# EAGLE schematic uSBasp (EAGLE 6.4)
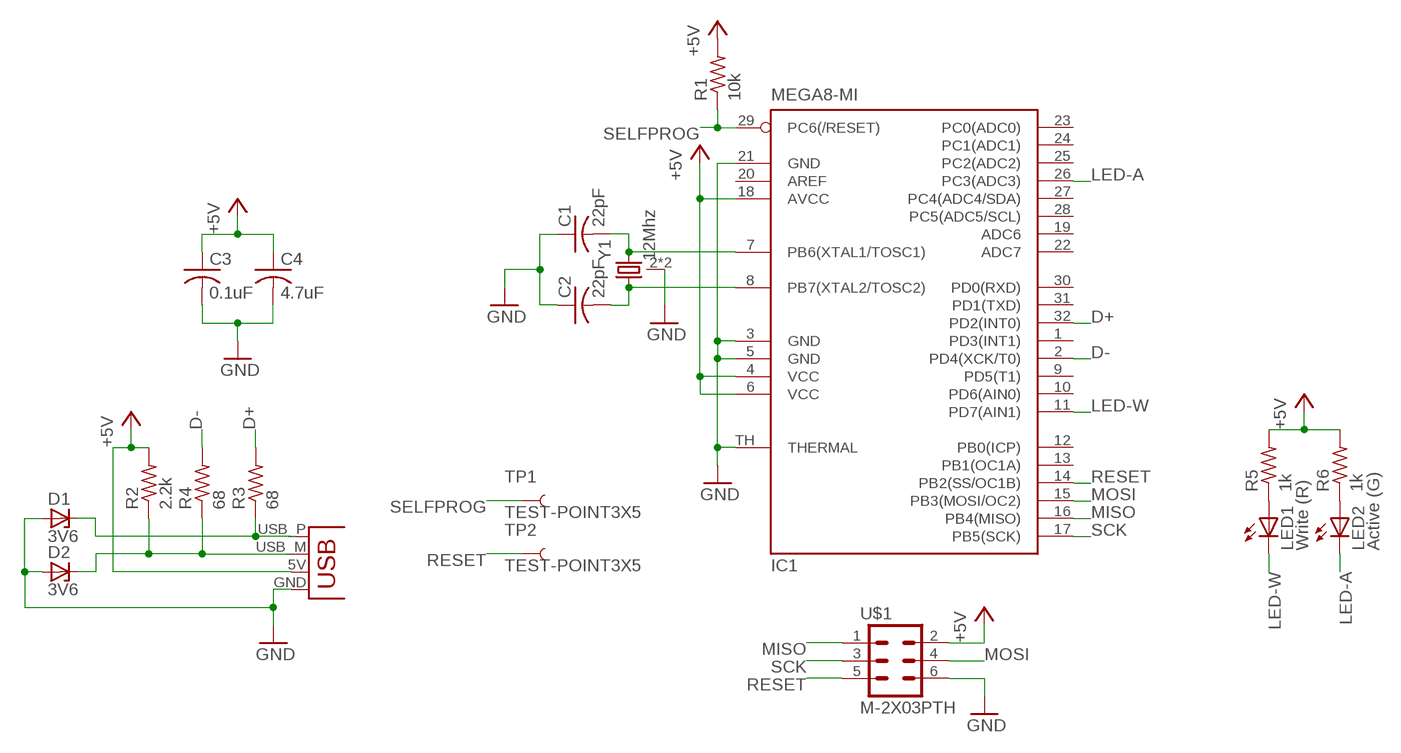
[diagram p0: schematic, sheet 1]

## Parts
C1  22pF  C-USC0402  [C0402]
C2  22pF  C-USC0402  [C0402]
C3  0.1uF  C-USC0402  [C0402]
C4  4.7uF  C-USC0402  [C0402]
D1  3V6  ZENER-DIODESOT23  [SOT23]
D2  3V6  ZENER-DIODESOT23  [SOT23]
IC1  MEGA8-MI  [MLF32-TH]
LED1  Write (R)  LEDSML0603  [SML0603]
LED2  Active (G)  LEDSML0603  [SML0603]
R1  10k  R-US_R0402  [R0402]
R2  2.2k  R-US_R0402  [R0402]
R3  68  R-US_R0402  [R0402]
R4  68  R-US_R0402  [R0402]
R5  1k  R-US_R0402  [R0402]
R6  1k  R-US_R0402  [R0402]
TP1  TEST-POINT3X5  [PAD.03X.05]
TP2  TEST-POINT3X5  [PAD.03X.05]
U$1  M-2X03PTH  [M-2X03-0.1-PTH-EDGE]
X1  USBPCB  [USB-A-PCB]
Y1  12Mhz  CRYSTAL  [CRYSTAL-SMD-3.2X2.5]

## Nets
+5V: C3.1 C4.1 IC1.4(VCC) IC1.6(VCC) IC1.18(AVCC) R1.2 R2.2 R5.2 R6.2 U$1.2 X1.5V(VBUS)
D+: IC1.32(PD2(INT0)) R3.2
D-: IC1.2(PD4(XCK/T0)) R4.2
GND: C1.1 C2.1 C3.2 C4.2 D1.1(A) D2.1(A) IC1.3(GND) IC1.5(GND) IC1.21(GND) IC1.TH(THERMAL) U$1.6 X1.GND Y1.2(GND) Y1.4(GND)
LED-A: IC1.26(PC3(ADC3)) LED2.C
LED-W: IC1.11(PD7(AIN1)) LED1.C
MISO: IC1.16(PB4(MISO)) U$1.1
MOSI: IC1.15(PB3(MOSI/OC2)) U$1.4
N$1: LED1.A R5.1
N$2: LED2.A R6.1
N$3: D1.3(C) R3.1 X1.USB_P(D+)
N$4: D2.3(C) R2.1 R4.1 X1.USB_M(D-)
N$6: C1.2 IC1.7(PB6(XTAL1/TOSC1)) Y1.3
N$7: C2.2 IC1.8(PB7(XTAL2/TOSC2)) Y1.1
RESET: IC1.14(PB2(SS/OC1B)) TP2.P$1 U$1.5
SCK: IC1.17(PB5(SCK)) U$1.3
SELFPROG: IC1.29(PC6(/RESET)) R1.1 TP1.P$1
Unconnected: IC1.1(PD3(INT1)) IC1.9(PD5(T1)) IC1.10(PD6(AIN0)) IC1.12(PB0(ICP)) IC1.13(PB1(OC1A)) IC1.19(ADC6) IC1.20(AREF) IC1.22(ADC7) IC1.23(PC0(ADC0)) IC1.24(PC1(ADC1)) IC1.25(PC2(ADC2)) IC1.27(PC4(ADC4/SDA)) IC1.28(PC5(ADC5/SCL)) IC1.30(PD0(RXD)) IC1.31(PD1(TXD))

## Library data of the parts
C1-C4 = rcl:C-US: CAPACITOR, American symbol
D1 D2 = diode:ZENER-DIODE: Z-Diode
IC1 = atmel:MEGA8-MI: MICROCONTROLLER 8 Kbytes FLASH, 1 kbytes SRAM, 512 bytes EEPROM, USART, 6-channel 10 bit ADC, 2-channel 8 bit ADC Pin compatible with Atmega48, ATMega88, ATMega168 Source: avr.lbr; MPN: ATMEGA88PA-MU; OC_FARNELL: 1715491; OC_NEWARK: 15R0272
LED1 LED2 = led:LED: LED OSRAM: - CHIPLED LG R971, LG N971, LY N971, LG Q971, LY Q971, LO R971, LY R971 LH N974, LH R974 LS Q976, LO Q976, LY Q976 LO Q996 - Hyper CHIPLED LW Q18S LB Q993, LB Q99A, LB R99A - SideLED LS A670, LO A670, LY A670, LG A670, LP A670 LB A673, LV A673, LT A673, LW A673 LH A674 LY A675 LS A676, LA A676, LO A676, LY A676, LW A676 LS A679, LY A679, LG A679 - Hyper Micro SIDELED® LS Y876, LA Y876, LO Y876, LY Y876 LT Y87S - SmartLED LW L88C, LW L88S LB L89C, LB L89S, LG L890 LS L89K, LO L89K, LY L89K LS L896, LA L896, LO L896, LY L896 - TOPLED LS T670, LO T670, LY T670, LG T670, LP T670 LSG T670, LSP T670, LSY T670, LOP T670, LYG T670 LG T671, LOG T671, LSG T671 LB T673, LV T673, LT T673, LW T673 LH T674 LS T676, LA T676, LO T676, LY T676, LB T676, LH T676, LSB T676, LW T676 LB T67C, LV T67C, LT T67C, LS T67K, LO T67K, LY T67K, LW E67C LS E67B, LA E67B, LO E67B, LY E67B, LB E67C, LV E67C, LT E67C LW T67C LS T679, LY T679, LG T679 LS T770, LO T770, LY T770, LG T770, LP T770 LB T773, LV T773, LT T773, LW T773 LH T774 LS E675, LA E675, LY E675, LS T675 LS T776, LA T776, LO T776, LY T776, LB T776 LHGB T686 LT T68C, LB T68C - Hyper Mini TOPLED® LB M676 - Mini TOPLED Santana® LG M470 LS M47K, LO M47K, LY M47K Source: http://www.osram.convergy.de LUXEON: - LUMILED® LXK2-PW12-R00, LXK2-PW12-S00, LXK2-PW14-U00, LXK2-PW14-V00 LXK2-PM12-R00, LXK2-PM12-S00, LXK2-PM14-U00 LXK2-PE12-Q00, LXK2-PE12-R00, LXK2-PE12-S00, LXK2-PE14-T00, LXK2-PE14-U00 LXK2-PB12-K00, LXK2-PB12-L00, LXK2-PB12-M00, LXK2-PB14-N00, LXK2-PB14-P00, LXK2-PB14-Q00 LXK2-PR12-L00, LXK2-PR12-M00, LXK2-PR14-Q00, LXK2-PR14-R00 LXK2-PD12-Q00, LXK2-PD12-R00, LXK2-PD12-S00 LXK2-PH12-R00, LXK2-PH12-S00 LXK2-PL12-P00, LXK2-PL12-Q00, LXK2-PL12-R00 Source: www.luxeon.com KINGBRIGHT: KA-3528ASYC Source: www.kingbright.com
R1-R6 = rcl:R-US_: RESISTOR, American symbol
TP1 TP2 = SparkFun-Passives:TEST-POINT: Bare copper test points for troubleshooting or ICT
U$1 = Jordi:M-2X03
X1 = SparkFun-Connectors:USB: USB Connectors USB-B-PTH is fully proven SKU : PRT-00139/CONN-08278 USB-miniB is fully proven SKU : PRT-00587 USB-A-PCB is untested. USB-A-H is throughly reviewed, but untested. Spark Fun Electronics SKU : PRT-00437 USB-B-SMT is throughly reviewed, but untested. Needs silkscreen touching up. USB-A-S has not been used/tested USB-MB-H has not been used/tested USB-MICROB has been used. CONN-09505
Y1 = Jordi:CRYSTAL